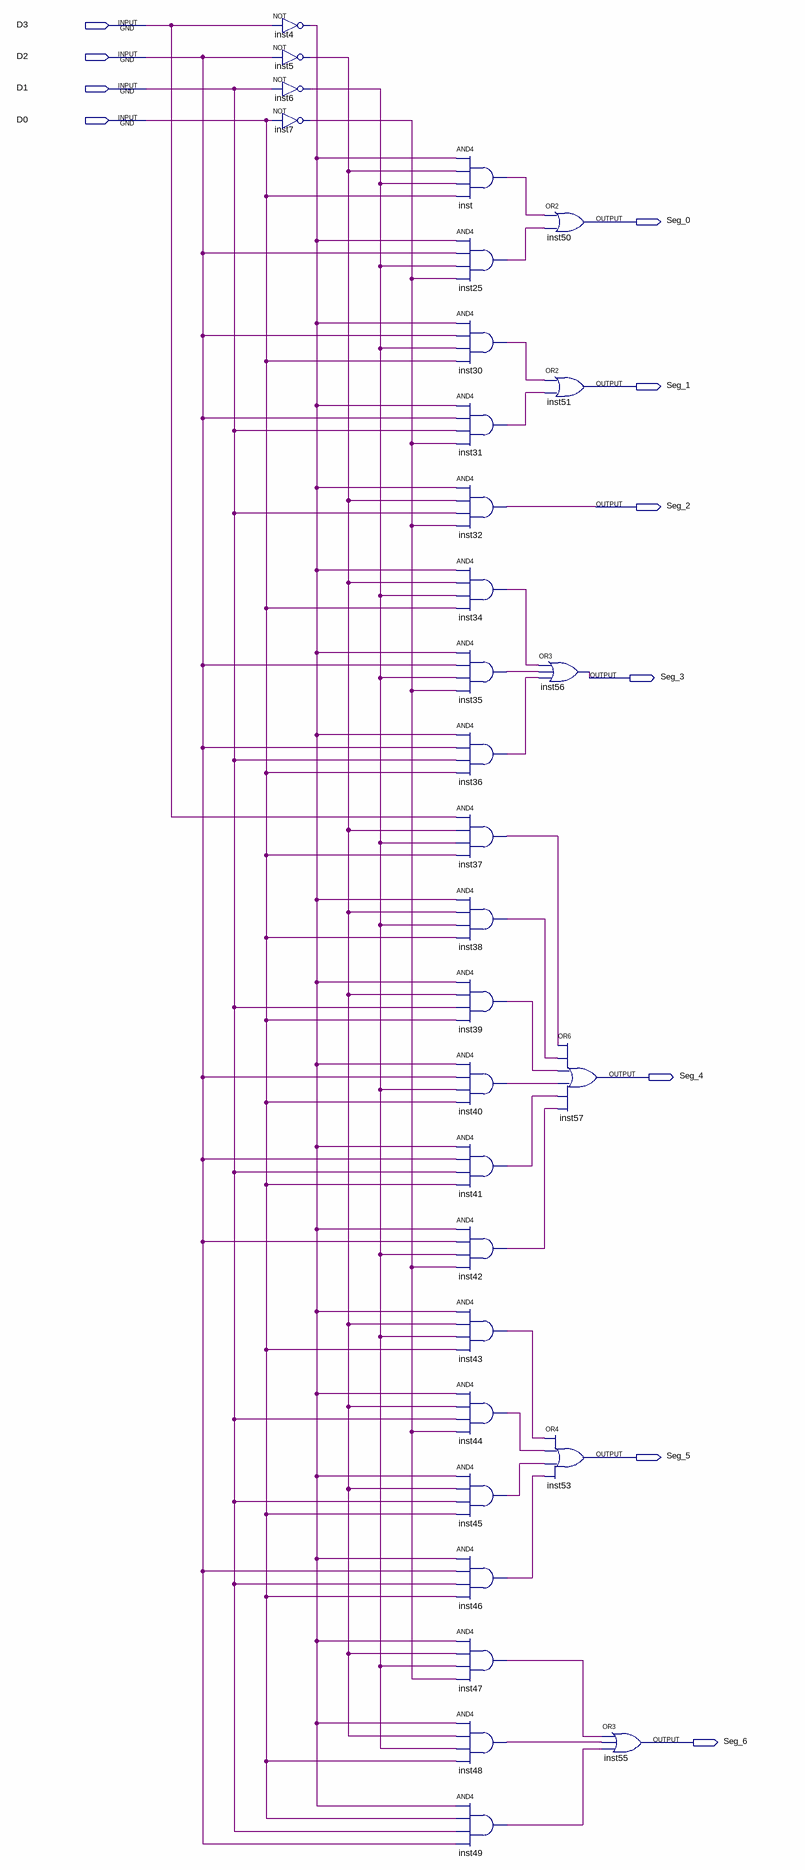
[diagram p0: schematic sheet]
// Quartus schematic 7_seg_drivert.bdf as structural Verilog: 31 symbols, 11 pins
module \7_seg_drivert  (
  input  D3,
  input  D2,
  input  D1,
  input  D0,
  output Seg_0,
  output Seg_1,
  output Seg_2,
  output Seg_3,
  output Seg_4,
  output Seg_5,
  output Seg_6
);

  wire inst4_out, inst5_out, inst6_out, inst7_out, inst25_out, inst30_out, inst31_out, inst34_out,
       inst35_out, inst36_out, inst37_out, inst38_out, inst39_out, inst40_out, inst41_out, inst42_out,
       inst43_out, inst44_out, inst45_out, inst46_out, inst47_out, inst48_out, inst49_out, inst_out;

  not inst4 (inst4_out, D3);
  not inst5 (inst5_out, D2);
  not inst6 (inst6_out, D1);
  not inst7 (inst7_out, D0);
  and inst (inst_out, inst4_out, inst5_out, inst6_out, D0);
  and inst25 (inst25_out, inst4_out, D2, inst6_out, inst7_out);
  and inst30 (inst30_out, inst4_out, D2, inst6_out, D0);
  and inst31 (inst31_out, inst4_out, D2, D1, inst7_out);
  and inst32 (Seg_2, inst4_out, inst5_out, D1, inst7_out);
  and inst34 (inst34_out, inst4_out, inst5_out, inst6_out, D0);
  and inst35 (inst35_out, inst4_out, D2, inst6_out, inst7_out);
  and inst36 (inst36_out, inst4_out, D2, D1, D0);
  and inst37 (inst37_out, D3, inst5_out, inst6_out, D0);
  and inst38 (inst38_out, inst4_out, inst5_out, inst6_out, D0);
  and inst39 (inst39_out, inst4_out, inst5_out, D1, D0);
  and inst40 (inst40_out, inst4_out, D2, inst6_out, D0);
  and inst41 (inst41_out, inst4_out, D2, D1, D0);
  and inst42 (inst42_out, inst4_out, D2, inst6_out, inst7_out);
  and inst43 (inst43_out, inst4_out, inst5_out, inst6_out, D0);
  and inst44 (inst44_out, inst4_out, inst5_out, D1, inst7_out);
  and inst45 (inst45_out, inst4_out, inst5_out, D1, D0);
  and inst46 (inst46_out, inst4_out, D2, D1, D0);
  and inst47 (inst47_out, inst4_out, inst5_out, inst6_out, inst7_out);
  and inst48 (inst48_out, inst4_out, inst5_out, inst6_out, D0);
  and inst49 (inst49_out, inst4_out, D0, D1, D2);
  or inst50 (Seg_0, inst_out, inst25_out);
  or inst51 (Seg_1, inst30_out, inst31_out);
  or inst56 (Seg_3, inst34_out, inst35_out, inst36_out);
  or inst57 (Seg_4, inst37_out, inst38_out, inst39_out, inst40_out, inst41_out, inst42_out);
  or inst53 (Seg_5, inst43_out, inst44_out, inst45_out, inst46_out);
  or inst55 (Seg_6, inst47_out, inst48_out, inst49_out);
endmodule
